# Altium schematic sheet START_JUMPER.SchDoc
size A4; SheetNumber: 9; SheetTotal: 9
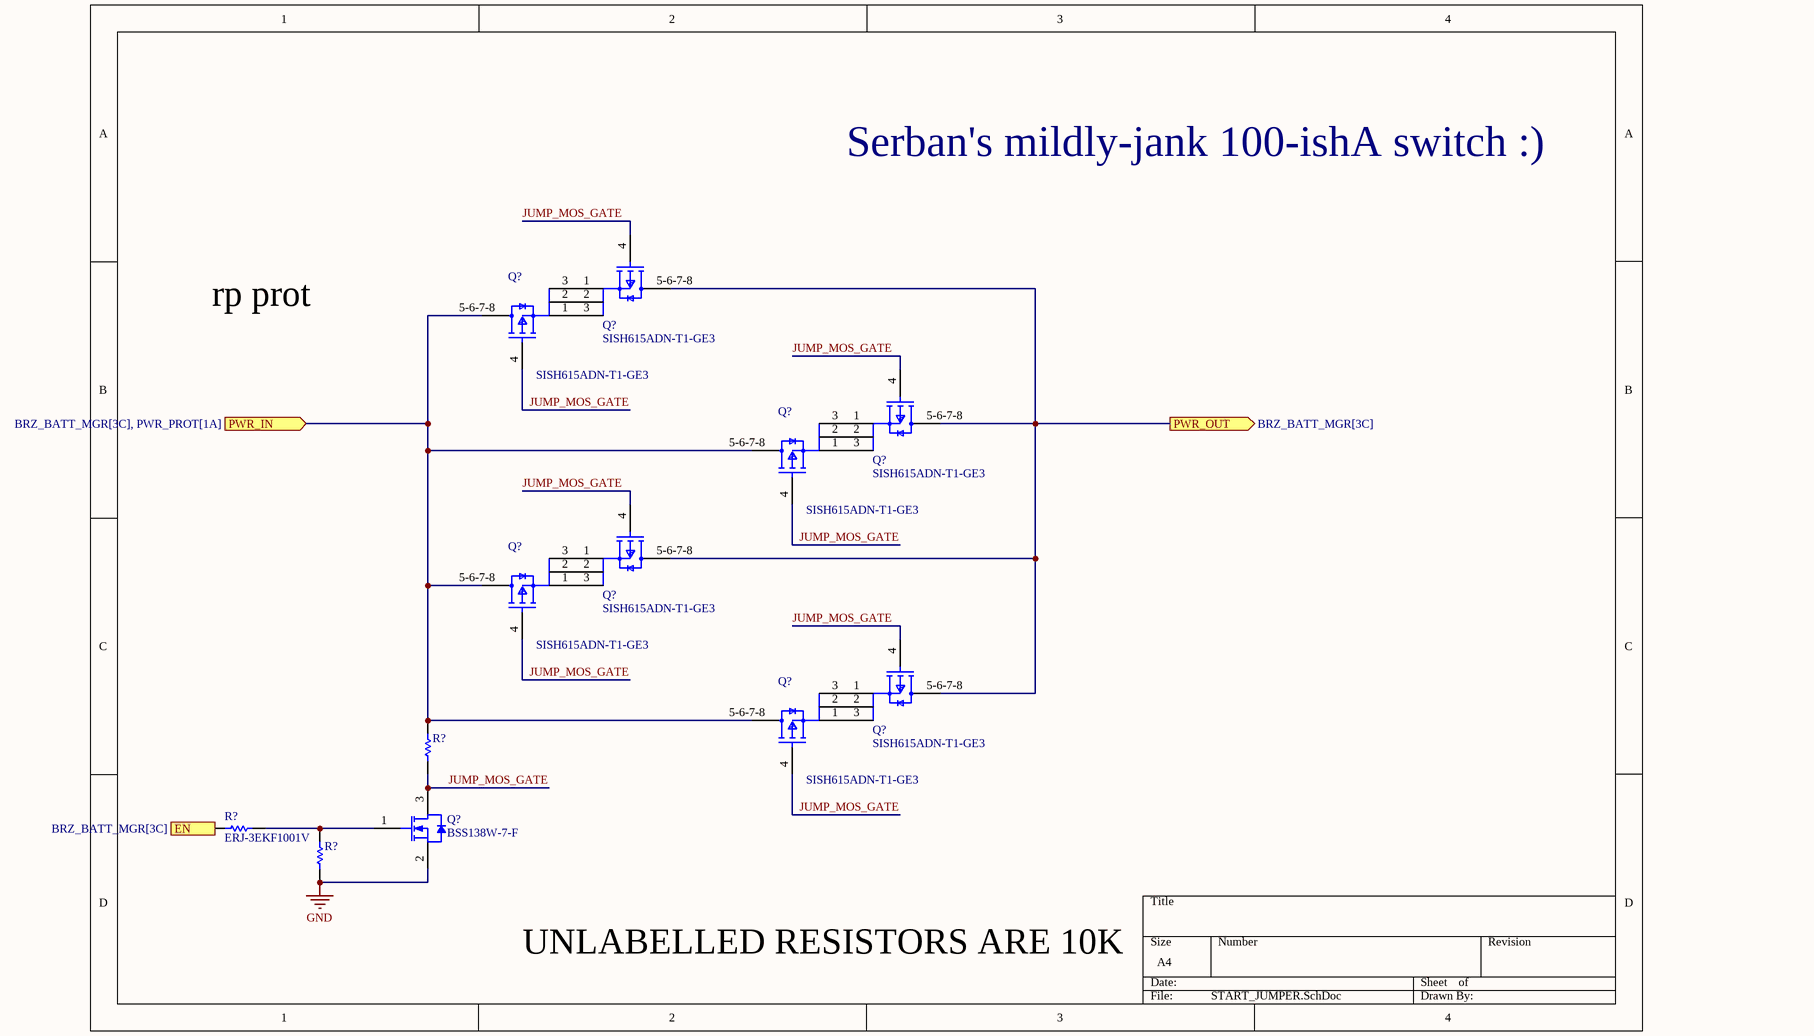
[diagram p0: START_JUMPER.SchDoc]

## Parts
(Parts that share a designator on the sheet are numbered #1, #2 ... from top to bottom, then left to right.)
Q?#1  SISH615ADN-T1-GE3  [SISH615ADN-T1-GE3-Footprint-1]
Q?#2  SISH615ADN-T1-GE3  [SISH615ADN-T1-GE3-Footprint-1]
Q?#3  SISH615ADN-T1-GE3  [SISH615ADN-T1-GE3-Footprint-1]
Q?#4  SISH615ADN-T1-GE3  [SISH615ADN-T1-GE3-Footprint-1]
Q?#5  SISH615ADN-T1-GE3  [SISH615ADN-T1-GE3-Footprint-1]
Q?#6  SISH615ADN-T1-GE3  [SISH615ADN-T1-GE3-Footprint-1]
Q?#7  SISH615ADN-T1-GE3  [SISH615ADN-T1-GE3-Footprint-1]
Q?#8  SISH615ADN-T1-GE3  [SISH615ADN-T1-GE3-Footprint-1]
Q?#9  BSS138W-7-F  [DIOD-SOT323-3_V]
R?#1  ERJ3EKF1002V  [RESC1609X55X30LL15T15]  (value not drawn)
R?#2  ERJ-3EKF1001V  [RESC1608X55X30LL15T15]
R?#3  ERJ3EKF1002V  [RESC1609X55X30LL15T15]  (value not drawn)

## Ports
EN (in, see BRZ_BATT_MGR[3C]), PWR_IN (in, see BRZ_BATT_MGR[3C], PWR_PROT[1A]), PWR_OUT (out, see BRZ_BATT_MGR[3C])

## Nets
GND: Q?#9.2(S) R?#3.1
JUMP_MOS_GATE: Q?#1.4(G) Q?#2.4(G) Q?#3.4(G) Q?#4.4(G) Q?#5.4(G) Q?#6.4(G) Q?#7.4(G) Q?#8.4(G) Q?#9.3(D) R?#1.1
PWR_IN: Q?#2.5-6-7-8(D) Q?#5.5-6-7-8(D) Q?#6.5-6-7-8(D) Q?#8.5-6-7-8(D) R?#1.2 ; port PWR_IN
PWR_OUT: Q?#1.5-6-7-8(D) Q?#3.5-6-7-8(D) Q?#4.5-6-7-8(D) Q?#7.5-6-7-8(D) ; port PWR_OUT
NetQ?#1_1: Q?#1.1(S) Q?#2.3(S)
NetQ?#1_2: Q?#1.2(S) Q?#2.2(S)
NetQ?#1_3: Q?#1.3(S) Q?#2.1(S)
NetQ?#3_1: Q?#3.1(S) Q?#5.3(S)
NetQ?#3_2: Q?#3.2(S) Q?#5.2(S)
NetQ?#3_3: Q?#3.3(S) Q?#5.1(S)
NetQ?#4_1: Q?#4.1(S) Q?#6.3(S)
NetQ?#4_2: Q?#4.2(S) Q?#6.2(S)
NetQ?#4_3: Q?#4.3(S) Q?#6.1(S)
NetQ?#7_1: Q?#7.1(S) Q?#8.3(S)
NetQ?#7_2: Q?#7.2(S) Q?#8.2(S)
NetQ?#7_3: Q?#7.3(S) Q?#8.1(S)
NetQ?#9_1: Q?#9.1(G) R?#2.1 R?#3.2

Not connected (* = marked no-connect by the designer): R?#2 2

## Notes on the sheet
- Serban's mildly-jank 100-ishA switch :)
- rp prot
- UNLABELLED RESISTORS ARE 10K

## Library data of the parts
Q?#1-Q?#8 = CMP-013-00036-1: Trans MOSFET P-CH 20V 22.1A 8-Pin PowerPAK 1212 EP T/R
Q?#9 = CMP-2000-05968-1: N-Channel Enhancement Mode Mosfet, 50 V, 200 mA, -55 to 150 degC, 6-Pin SOT-323, RoHS, Tape and Reel; Typical Turn-Off Delay Time: 20ns; Number of Channels: 1Channel; Type: EnhancementModeFieldEffectTransistor; Brand: DiodesIncorporated; Vds - Drain-Source Breakdown Voltage: 75V; Vgs - Gate-Source Voltage: 20V; Rds On - Drain-Source Resistance: 1.4Ohms; Transistor Type: 1N-Channel; Configuration: Single; Unit Weight: 0.000212oz; Pd - Power Dissipation: 200mW; Id - Continuous Drain Current: 200mA; Forward Transconductance - Min: 0.1S; Manufacturer URL: http://www.diodes.com/; Series: BSS138; Package Description: 3-Pin Small Outline Transistor, Body 2 x 1.25 mm, Pitch 0.65 mm; Mounting Technology: SurfaceMount; Product Category: MOSFET; RoHS: True; Maximum Operating Temperature: +150C; Height: 1mm; Length: 2.2mm; Technology: Si; Width: 1.35mm; Datasheet URL: http://www.diodes.com/_files/datasheets/ds30206.pdf; Manufacturer: DiodesIncorporated; Package / Case: SOT-323-3; Typical Turn-On Delay Time: 20ns; Transistor Polarity: N-Channel; Factory Pack Quantity: 3000; Packaging: Reel; Product: MOSFETSmallSignal; Datasheet Version: Rev. 11-2, 09/2013; Package Reference: SOT323; Minimum Operating Temperature: -55C; Mounting Style: SMD/SMT; Channel Mode: Enhancement
R?#1 R?#3 = CMP-1012-00623-3: Chip Resistor, 10 KOhm, +/- 1%, 0.1 W, -55 to 155 degC, 0603 (1608 Metric), RoHS, Tape and Reel; Manufacturer: Panasonic; Voltage Rating: 75V; Case\/Package: 0603; Power Rating: 100mW; Resistance: 10KOhm; Temperature Coefficient: 100ppm\/degreesC; Number of Pins: 2; Package Reference: 603; Depth: 0.8mm; Mount: SurfaceMount; Package Description: 2-Pin Surface Mount Device, Body 1.6 x 0.85 mm; Datasheet Version: 02/2017; Length: 1.6mm; Lead Free: LeadFree; Height: 0.45mm; Number of Terminations: 2; Max Power Dissipation: 100mW; Min Operating Temperature: -55degC; Datasheet URL: https://industrial.panasonic.com/cdbs/www-data/pdf/RDA0000/AOA0000C304.pdf; Termination: SMD/SMT; Case Code (Metric): 1608; Case Code (Imperial): 0603; Tolerance: 1%; Max Operating Temperature: 155degC; RoHSCompliant: true; Voltage Rating (DC): 75V; Radiation Hardening: No; Packaging: TapeandReel; Composition: ThickFilm; Mounting Technology: SurfaceMount; Manufacturer URL: http://www.panasonic.com/; Width: 0.031inch; REACH SVHC: NoSVHC; Contact Plating: Tin; Military Standard: Not; Package Quantity: 1
R?#2 = CMP-2000-00180-1: Manufacturer: Panasonic; Part Number: ERJ-3EKF1001V